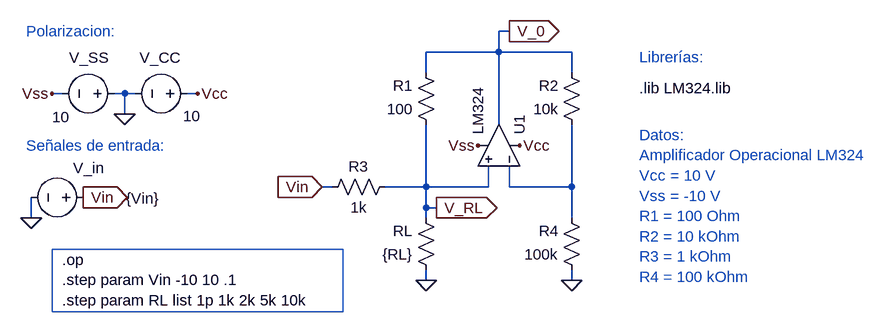
[diagram p0: schematic Lab_1_Circ_2_V0.asc]
Lab_1_Circ_2_V0.asc, the LTspice schematic file:
Version 4
SHEET 1 1560 680
WIRE 384 -256 368 -256
WIRE 368 -224 368 -256
WIRE 368 -224 256 -224
WIRE 480 -224 368 -224
WIRE 256 -192 256 -224
WIRE 480 -192 480 -224
WIRE -304 -160 -320 -160
WIRE -208 -160 -224 -160
WIRE -192 -160 -208 -160
WIRE -96 -160 -112 -160
WIRE -208 -128 -208 -160
WIRE 368 -112 368 -224
WIRE 112 -16 96 -16
WIRE 256 -16 256 -112
WIRE 256 -16 192 -16
WIRE 352 -16 352 -48
WIRE 352 -16 256 -16
WIRE 384 -16 384 -48
WIRE 480 -16 480 -112
WIRE 480 -16 384 -16
WIRE 256 16 256 -16
WIRE 272 16 256 16
WIRE -352 32 -352 0
WIRE 256 32 256 16
WIRE 480 32 480 -16
WIRE 256 128 256 112
WIRE 480 128 480 112
FLAG 256 128 0
FLAG -96 -160 Vcc
FLAG 400 -80 Vcc
FLAG -320 -160 Vss
FLAG 336 -80 Vss
FLAG -208 -128 0
FLAG -352 32 0
FLAG 384 -256 V_0
IOPIN 384 -256 Out
FLAG 96 -16 Vin
IOPIN 96 -16 In
FLAG -272 0 Vin
IOPIN -272 0 Out
FLAG 480 128 0
FLAG 272 16 V_RL
IOPIN 272 16 Out
SYMBOL OpAmps\\opamp2 432 -80 M270
SYMATTR InstName U1
SYMATTR Value LM324
SYMBOL res 272 -96 R180
WINDOW 0 36 76 Left 2
WINDOW 3 36 40 Left 2
SYMATTR InstName R1
SYMATTR Value 100
SYMBOL res 496 -96 R180
WINDOW 0 36 76 Left 2
WINDOW 3 36 40 Left 2
SYMATTR InstName R2
SYMATTR Value 10k
SYMBOL res 208 -32 R90
WINDOW 0 0 56 VBottom 2
WINDOW 3 32 56 VTop 2
SYMATTR InstName R3
SYMATTR Value 1k
SYMBOL res 496 128 R180
WINDOW 0 36 76 Left 2
WINDOW 3 36 40 Left 2
SYMATTR InstName R4
SYMATTR Value 100k
SYMBOL res 272 128 R180
WINDOW 0 36 76 Left 2
WINDOW 3 36 40 Left 2
SYMATTR InstName RL
SYMATTR Value {RL}
SYMBOL voltage -256 0 M270
WINDOW 0 45 31 VLeft 2
WINDOW 3 -2 -50 VLeft 2
WINDOW 123 0 0 Left 0
WINDOW 39 0 0 Left 0
SYMATTR InstName V_in
SYMATTR Value {Vin}
SYMBOL voltage -96 -160 R90
WINDOW 0 -55 25 VRight 2
WINDOW 3 35 -5 VRight 2
WINDOW 123 0 0 Left 0
WINDOW 39 0 0 Left 0
SYMATTR InstName V_CC
SYMATTR Value 10
SYMBOL voltage -208 -160 R90
WINDOW 0 -55 25 VRight 2
WINDOW 3 36 85 VRight 2
WINDOW 123 0 0 Left 0
WINDOW 39 0 0 Left 0
SYMATTR InstName V_SS
SYMATTR Value 10
TEXT 584 -168 Left 2 !.lib LM324.lib
TEXT 584 -216 Left 2 ;Librerías:
TEXT -360 -256 Left 2 ;Polarizacion:
TEXT -360 -80 Left 2 ;Señales de entrada:
TEXT 584 -96 Left 2 ;Datos:\nAmplificador Operacional LM324\nVcc = 10 V\nVss = -10 V\nR1 = 100 Ohm\nR2 = 10 kOhm\nR3 = 1 kOhm\nR4 = 100 kOhm
TEXT -304 96 Left 2 !.op\n.step param Vin -10 10 .1\n.step param RL list 1p 1k 2k 5k 10k
RECTANGLE Normal 128 176 -320 80

The netlist it stands for:
* Lab_1_Circ_2_V0.asc
XU1 V_RL N001 Vcc Vss V_0 LM324  ; pins In+ In- V+ V- OUT
R1 V_RL V_0 100
R2 N001 V_0 10k
R3 V_RL Vin 1k
R4 0 N001 100k
RL 0 V_RL {RL}
V_in Vin 0 {Vin}
V_CC Vcc 0 10
V_SS 0 Vss 10
.lib LM324.lib
* Librerías:
* Polarizacion:
* Señales de entrada:
* Datos:
* Amplificador Operacional LM324
* Vcc = 10 V
* Vss = -10 V
* R1 = 100 Ohm
* R2 = 10 kOhm
* R3 = 1 kOhm
* R4 = 100 kOhm
.op
.step param Vin -10 10 .1
.step param RL list 1p 1k 2k 5k 10k
.backanno
.end

* Results of the author's LTspice run, read from the files saved beside the schematic
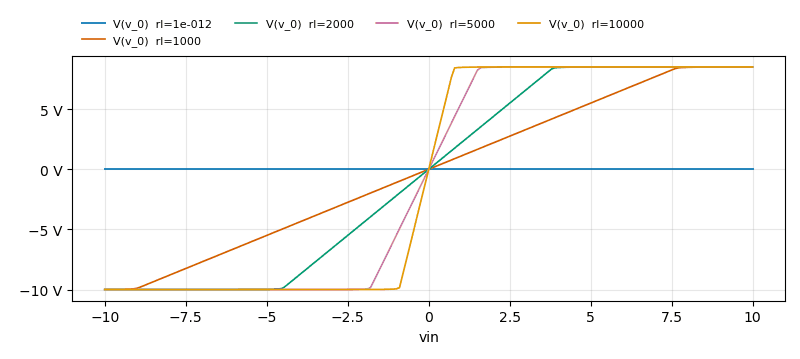
[diagram p1: Operating Point of Lab_1_Circ_2_V0.asc, plotted from the saved traces]
* Operating Point, 5 runs:
*   V(v_0) [rl=1e-012]: -236.4 µV at vin=-10 , -236.4 µV at vin=10 , min -236.4 µV, max -236.4 µV
*   V(v_0) [rl=1000]: -9.99 V at vin=-10 , 8.494 V at vin=10 , min -9.99 V, max 8.494 V
*   V(v_0) [rl=2000]: -9.996 V at vin=-10 , 8.494 V at vin=10 , min -9.996 V, max 8.494 V
*   V(v_0) [rl=5000]: -9.996 V at vin=-10 , 8.494 V at vin=10 , min -9.996 V, max 8.494 V
*   V(v_0) [rl=10000]: -9.996 V at vin=-10 , 8.494 V at vin=10 , min -9.996 V, max 8.494 V
* From the log:
*   Semiconductor Device Operating Points:
*                           --- Diodes ---
*   Name:    d:u1:p      d:u1:ln     d:u1:lp     d:u1:e      d:u1:c
*   Model:    u1:dx       u1:dx       u1:dx       u1:dx       u1:dx
*   Id:     -2.00e-11   -4.00e-11   -4.00e-11   -9.40e-12   -7.90e-12
*   Vd:     -2.00e+01   -4.00e+01   -4.00e+01   -9.40e+00   -7.90e+00
*   Req:     1.00e+12    1.00e+12    1.00e+12    1.00e+12    1.00e+12
*   CAP:     0.00e+00    0.00e+00    0.00e+00    0.00e+00    0.00e+00
*                           --- Bipolar Transistors ---
*   Name:     q:u1:2      q:u1:1
*   Model:     u1:qx       u1:qx
*   Ib:      -1.99e-08   -1.99e-08
*   Ic:      -4.98e-06   -4.99e-06
*   Vbe:     -5.83e-01   -5.83e-01
*   Vbc:      9.96e+00    9.96e+00
*   Vce:     -1.05e+01   -1.05e+01
*   BetaDC:   2.50e+02    2.50e+02
*   Gm:       1.93e-04    1.93e-04
*   Rpi:      1.30e+06    1.30e+06
*   Rx:       0.00e+00    0.00e+00
*   Ro:       0.00e+00    0.00e+00
*   Cbe:      0.00e+00    0.00e+00
*   Cbc:      0.00e+00    0.00e+00
*   Cjs:      0.00e+00    0.00e+00
*   BetaAC:   2.50e+02    2.50e+02
*   Cbx:      0.00e+00    0.00e+00
*   Ft:       0.00e+00    0.00e+00